# EasyEDA schematic SCH_5v3a-lmr51430_2023-02-02.json
TITLE: Sheet_1; REV: 1.0; Date: 2023-01-21; Sheet: 1/1; Drawn By: samhyams; Company: Your Company
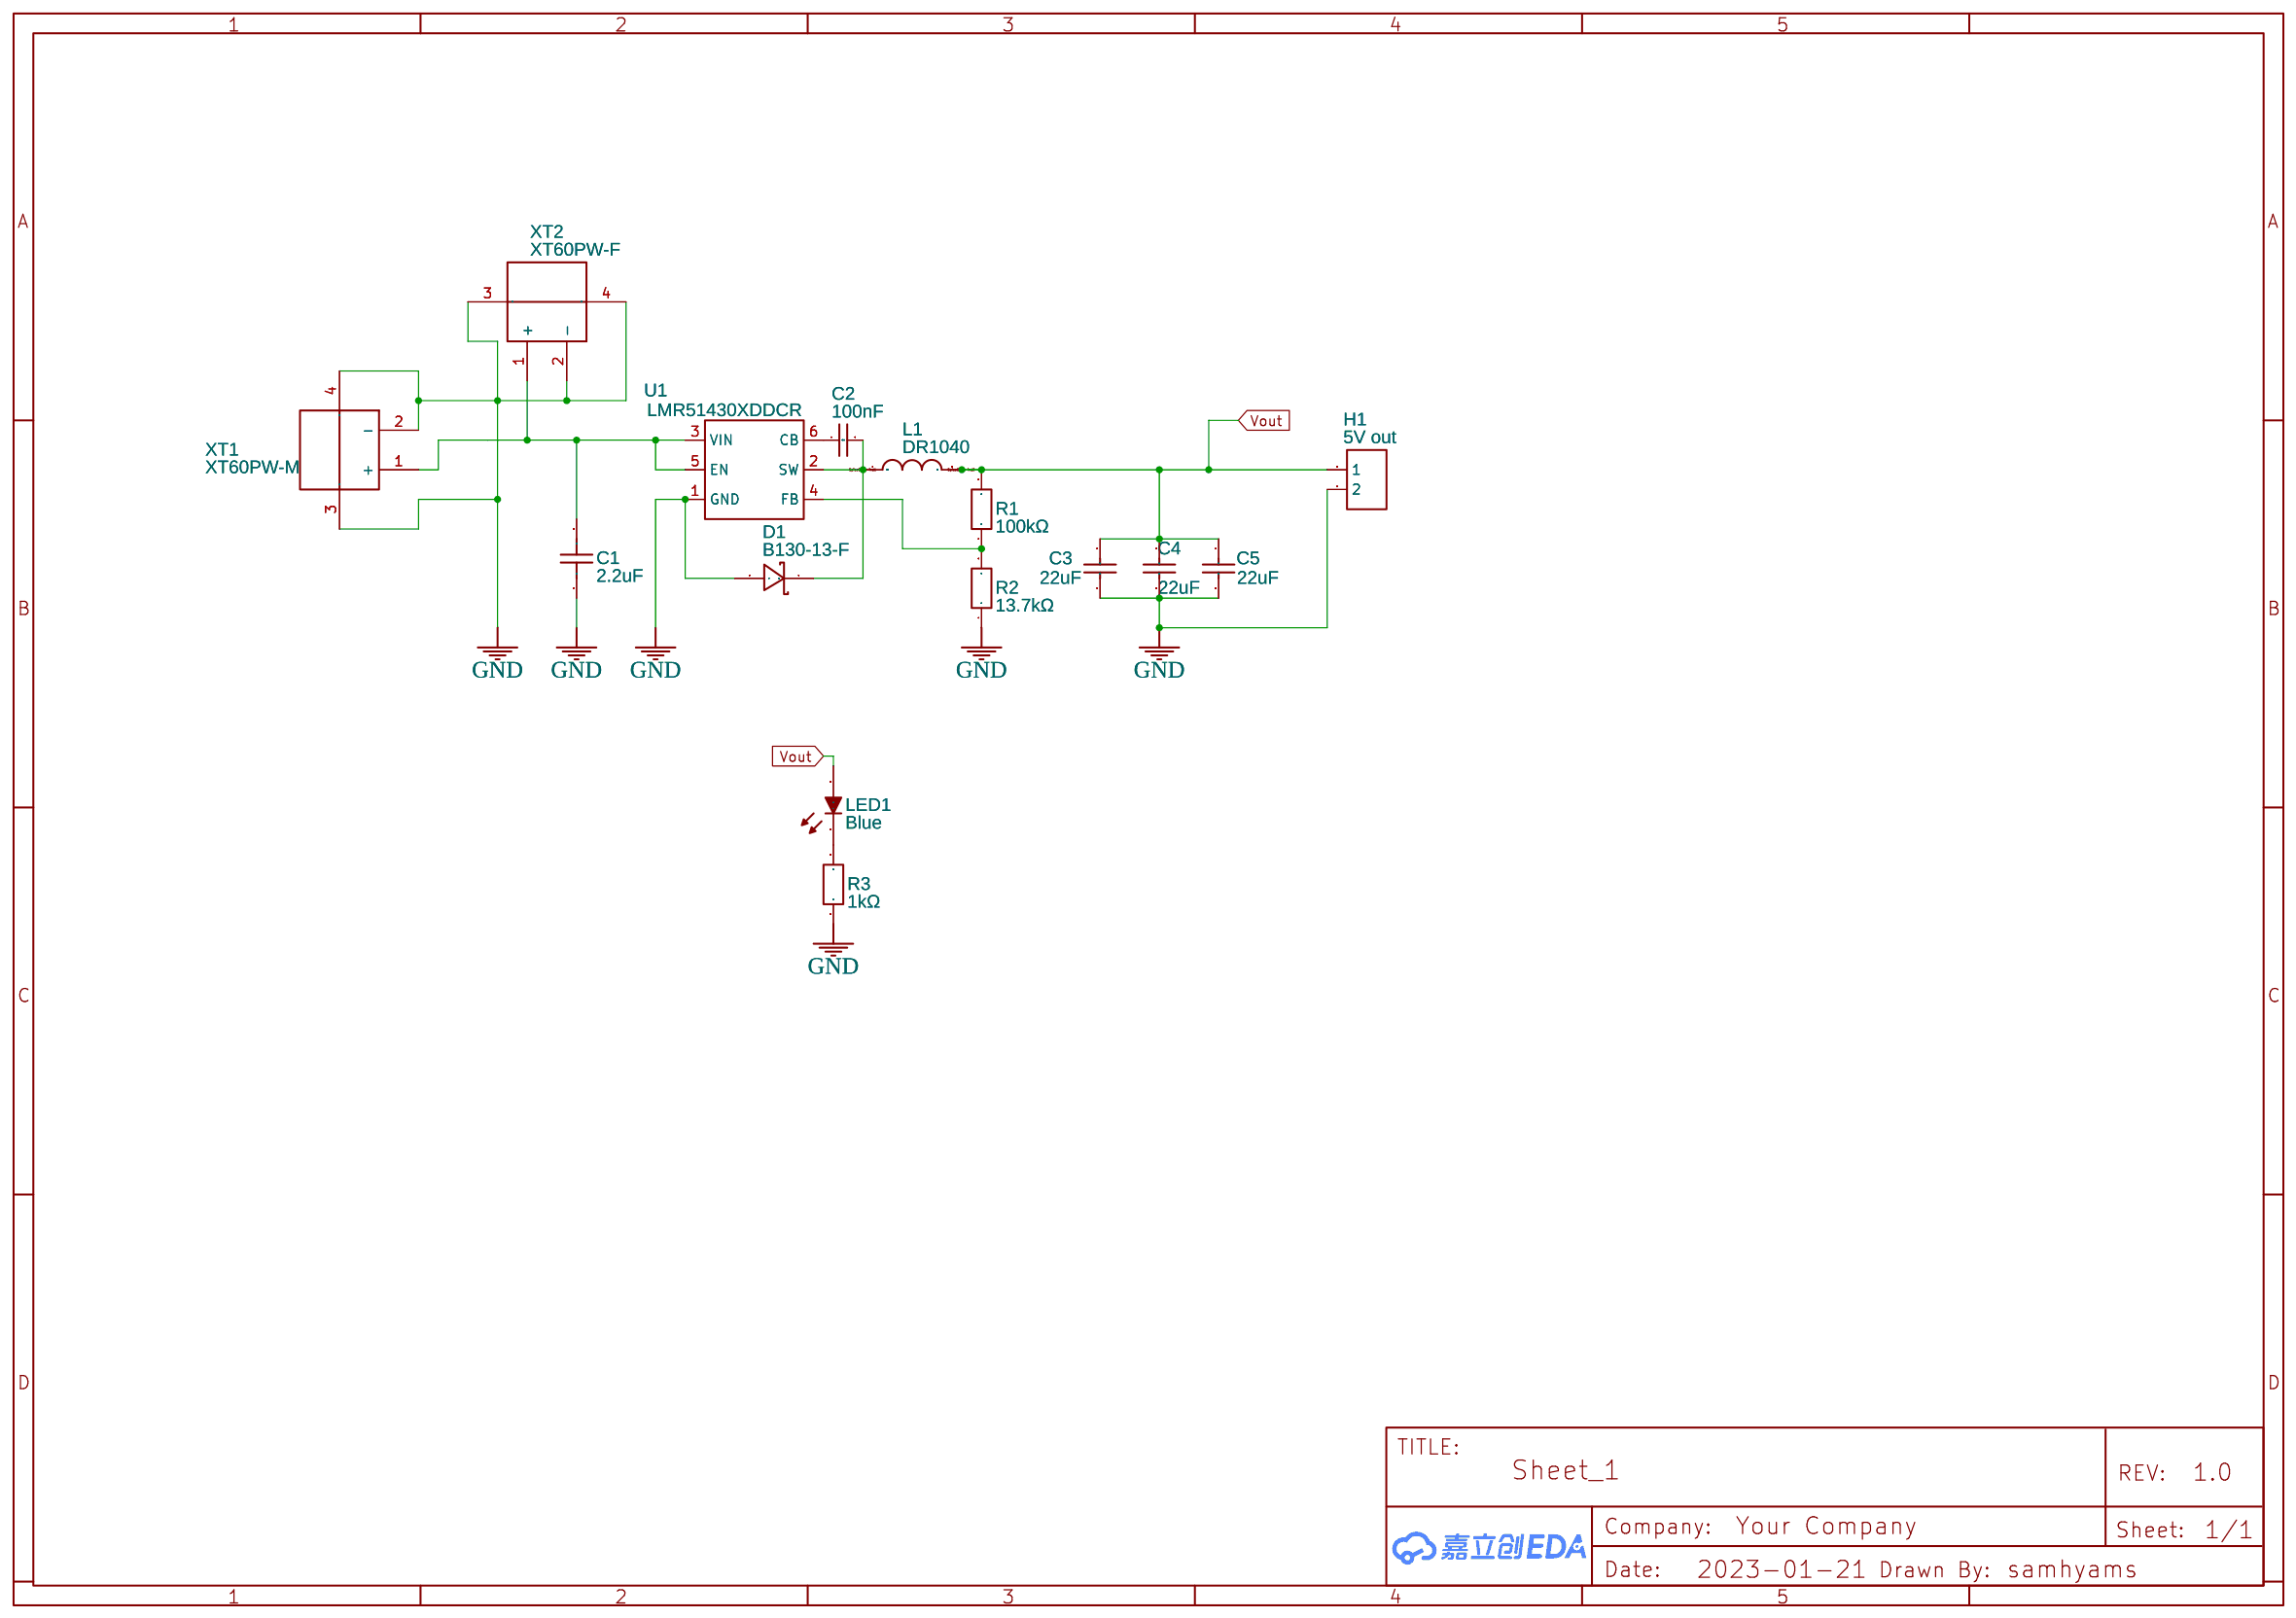
[diagram p0: schematic sheet]

## Parts
C1  2.2uF  [C0805]
C2  100nF  [C0603]
C3  22uF  [C0805]
C4  22uF  [C0805]
C5  22uF  [C0805]
D1  B130-13-F  [SMA_L4.3-W2.6-LS5.2-RD]
H1  5V out  [HDR-F-2.54_1X2]
L1  DR1040  [DR1040]
LED1  Blue  [LED0603]
R1  100kΩ  [R0201]
R2  13.7kΩ  [R0201]
R3  1kΩ  [R0402]
U1  LMR51430XDDCR  [SOT-23-6_L2.9-W1.6-P0.95-LS2.8-BL]
XT1  XT60PW-M  [XT60PW-M]
XT2  XT60PW-F  [XT60PW-F]

## Library data of the parts
C1 = 2.2uF 0805 50 VDC: Supplier: Mouser; Manufacturer Part: CL21B225KBYNNWE; Manufacturer: Samsung Electro-Mechanics; Supplier Part: 187-CL21B225KBYNNWE; link: https://br.mouser.com/ProductDetail/Samsung-Electro-Mechanics/CL21B225KBYNNWE?qs=81r%252BiQLm7BSQ0niHgk%2FU1g%3D%3D; Contributor: daagno; Voltage: 50 VDC
C2 = 100nF CL10B104KB8NNNC: Supplier: LCSC; Manufacturer: SAMSUNG; Manufacturer Part: CL10B104KB8NNNC; Supplier Part: C1591; JLCPCB Part Class: Extended Part; Contributor: Leonardo Moura
C3-C5 = CL21A226MPQNNNE: Supplier: LCSC; Manufacturer: SAMSUNG(三星); Supplier Part: C29277; JLCPCB Part Class: Extended Part
D1 = B130-13-F: Supplier Part: C134423; Supplier: LCSC; Manufacturer: DIODES(美台); Contributor: LCSC; JLCPCB Part Class: Extended Part
H1 = HDR-F-2.54_1x2: Supplier Part: C49661; Supplier: LCSC; Contributor: LCEDA_Lib
L1 = INDUCT-DR1040: Contributor: noexpire000
LED1 = LED0603: Supplier: reichelt; Supplier Part: 19-213/R6C-AQ1R2B/3T; Manufacturer: everlight; Manufacturer Part: LED EL 0603 RT; Contributor: Philip Schulz; JLCPCB Part Class: Extended Part; link: https://www.reichelt.at/at/de/led-smd-1608-0603-rot-180-mcd-120--led-el-0603-rt-p156256.html?&trstct=pos_9&nbc=1
R1 R2 = ERJ-1GEF1003C: Supplier: LCSC; Supplier Part: C2096564; Manufacturer: PANASONIC(松下); JLCPCB Part Class: Extended Part; Contributor: lcsc
R3 = RMCF0402FT499R: Supplier: LCSC; Supplier Part: C9900006875; Manufacturer: null; JLCPCB Part Class: Extended Part; Contributor: LCSC
U1 = LMR51430XDDCR: Supplier: LCSC; Supplier Part: C5185863; Manufacturer: null; link: https://atta.szlcsc.comnull; Contributor: lcsc; JLCPCB Part Class: Extended Part
XT1 = XT60PW-M: Manufacturer: Changzhou Amass Elec; Supplier: LCSC; Supplier Part: C98732; link: https://datasheet.lcsc.com/szlcsc/Changzhou-Amass-Elec-XT60PW-M_C98732.pdf; Contributor: Junikos
XT2 = XT60PW-F: Contributor: samhyams

## Nets
GND: C1.1 C3.1 C4.1 C5.1 D1.2(A) H1.2 R2.1 R3.1 U1.1(GND) XT1.2(-) XT1.3(NA) XT1.4(NA) XT2.2(-) XT2.3(NA) XT2.4(NA)
Vout: C3.2 C4.2 C5.2 H1.1 L1.2(P$2) LED1.1(+) R1.2
Net-(C1-2): C1.2 U1.3(VIN) U1.5(EN) XT1.1(+) XT2.1(+)
Net-(C2-1): C2.1 U1.6(CB)
Net-(C2-2): C2.2 D1.1(C) L1.1(P$1) U1.2(SW)
Net-(LED1-2): LED1.2(-) R3.2
Net-(R1-1): R1.1 R2.2 U1.4(FB)
